# Altium schematic sheet module_tester_v2.0.SchDoc
size 508 x 381 mm
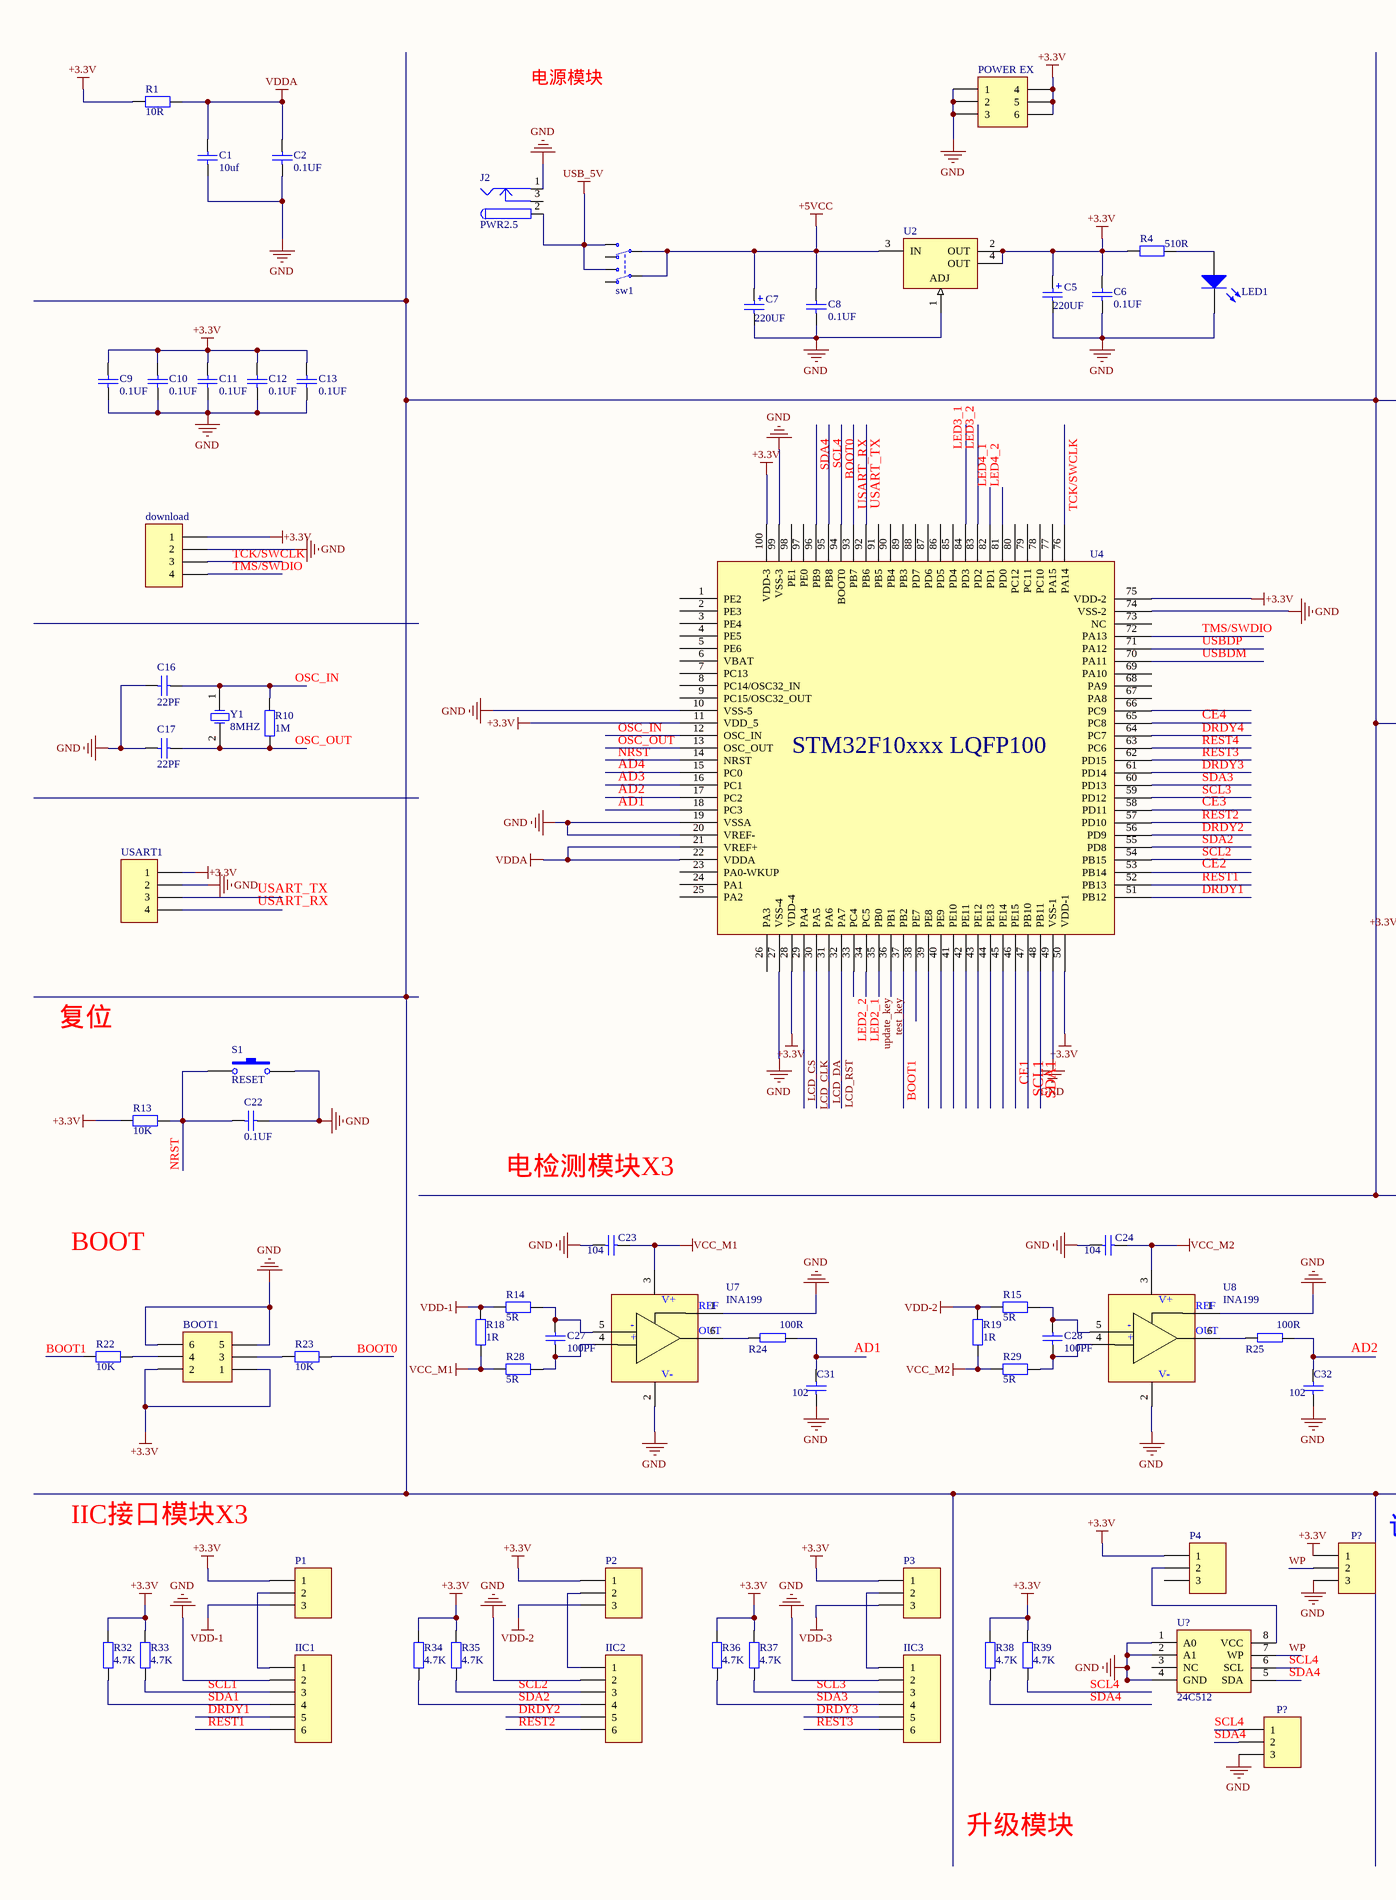
[diagram p0: module_tester_v2.0.SchDoc, left]
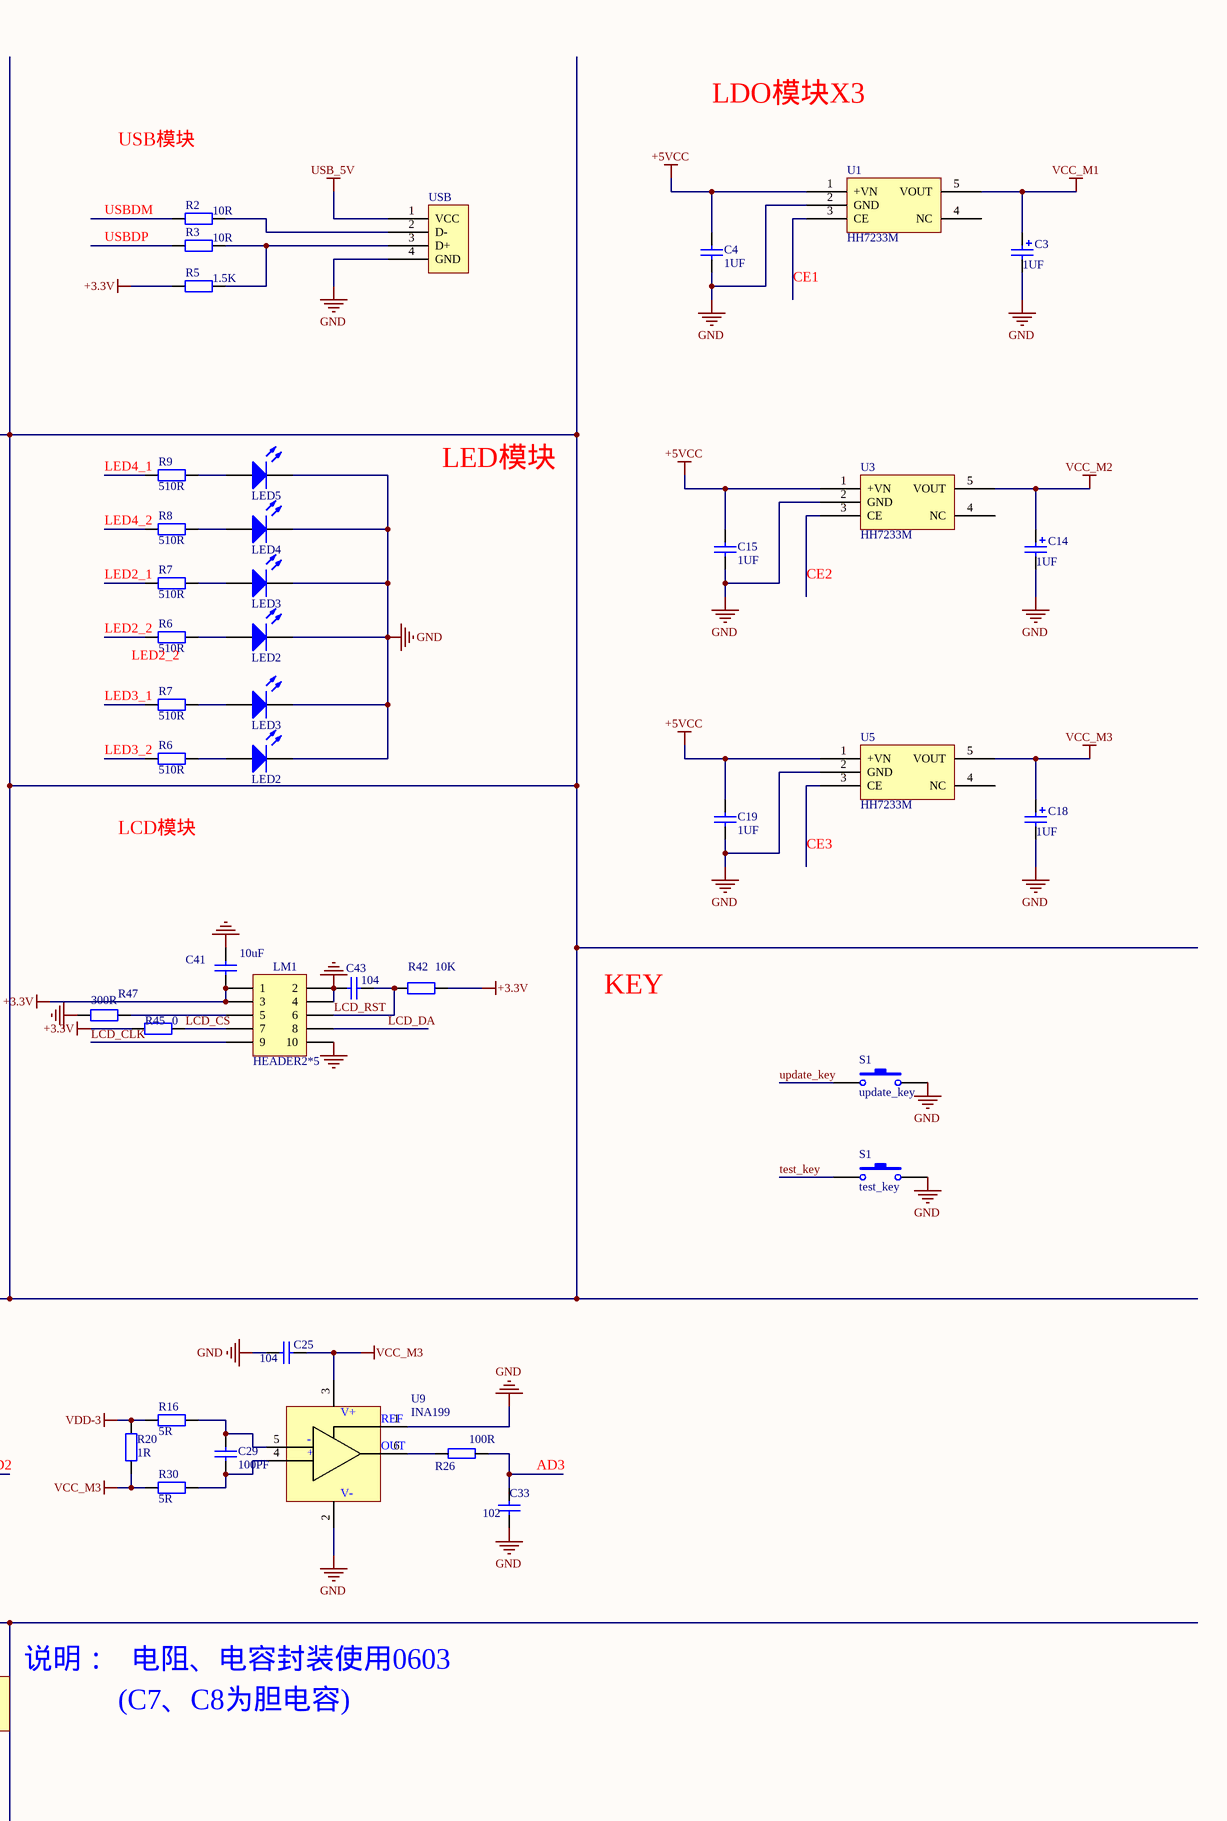
[diagram p1: module_tester_v2.0.SchDoc, right]

## Parts
(Parts that share a designator on the sheet are numbered #1, #2 ... from top to bottom, then left to right.)
BOOT1  Header 3X2  [IDC6]  (value not drawn)
C1  value 10uf  [C0603E]  (hidden comment: Cap)
C2  value 0.1UF  [C0603E]  (hidden comment: Cap)
C3  value 1UF  [C0603E]  (hidden comment: Cap Pol2)
C4  value 1UF  [C0603E]  (hidden comment: Cap)
C5  value 220UF  [C3528]  (hidden comment: Cap Pol2)
C6  value 0.1UF  [C0603E]  (hidden comment: Cap)
C7  value 220UF  [C3528]  (hidden comment: Cap Pol2)
C8  value 0.1UF  [C0603E]  (hidden comment: Cap)
C9  value 0.1UF  [C0603E]  (hidden comment: Cap)
C10  value 0.1UF  [C0603E]  (hidden comment: Cap)
C11  value 0.1UF  [C0603E]  (hidden comment: Cap)
C12  value 0.1UF  [C0603E]  (hidden comment: Cap)
C13  value 0.1UF  [C0603E]  (hidden comment: Cap)
C14  value 1UF  [C0603E]  (hidden comment: Cap Pol2)
C15  value 1UF  [C0603E]  (hidden comment: Cap)
C16  value 22PF  [C0603E]  (hidden comment: Cap)
C17  value 22PF  [C0603E]  (hidden comment: Cap)
C18  value 1UF  [C0603E]  (hidden comment: Cap Pol2)
C19  value 1UF  [C0603E]  (hidden comment: Cap)
C22  value 0.1UF  [C0603E]  (hidden comment: Cap)
C23  104  [C0603E]
C24  104  [C0603E]
C25  104  [C0603E]
C27  value 100PF  [C0603E]  (hidden comment: Cap)
C28  value 100PF  [C0603E]  (hidden comment: Cap)
C29  value 100PF  [C0603E]  (hidden comment: Cap)
C31  102  [C0603E]
C32  102  [C0603E]
C33  102  [C0603E]
C41  10uF  [C0805]
C43  104  [C0805]
download  Header 4H  [header4]  (value not drawn)
IIC1  MHDR1X6  [header6]  (value not drawn)
IIC2  MHDR1X6  [header6]  (value not drawn)
IIC3  MHDR1X6  [header6]  (value not drawn)
J2  PWR2.5  [DC-POWER]
LED1  LED-RED-0603  [LED0603]  (value not drawn)
LED2#1  LED-RED-0603  [LED0603]  (value not drawn)
LED2#2  LED-RED-0603  [LED0603]  (value not drawn)
LED3#1  LED-RED-0603  [LED0603]  (value not drawn)
LED3#2  LED-RED-0603  [LED0603]  (value not drawn)
LED4  LED-RED-0603  [LED0603]  (value not drawn)
LED5  LED-RED-0603  [LED0603]  (value not drawn)
LM1  HEADER2*5  [IDC10]
P1  Header 3  [header3]  (value not drawn)
P2  Header 3  [header3]  (value not drawn)
P3  Header 3  [header3]  (value not drawn)
P4  Header 3  [header3]  (value not drawn)
P?#1  Header 3  [header3]  (value not drawn)
P?#2  Header 3  [header3]  (value not drawn)
POWER_EX  Header 3X2A  [IDC6]  (value not drawn)
R1  value 10R  [R0603E]  (hidden comment: Res2)
R2  value 10R  [R0603E]  (hidden comment: Res2)
R3  value 10R  [R0603E]  (hidden comment: Res2)
R4  value 510R  [R0603E]  (hidden comment: Res2)
R5  value 1.5K  [R0603E]  (hidden comment: Res2)
R6#1  value 510R  [R0603E]  (hidden comment: Res2)
R6#2  value 510R  [R0603E]  (hidden comment: Res2)
R7#1  value 510R  [R0603E]  (hidden comment: Res2)
R7#2  value 510R  [R0603E]  (hidden comment: Res2)
R8  value 510R  [R0603E]  (hidden comment: Res2)
R9  value 510R  [R0603E]  (hidden comment: Res2)
R10  value 1M  [R0603E]  (hidden comment: Res2)
R13  value 10K  [R0603E]  (hidden comment: Res2)
R14  value 5R  [R0603E]  (hidden comment: Res2)
R15  value 5R  [R0603E]  (hidden comment: Res2)
R16  value 5R  [R0603E]  (hidden comment: Res2)
R18  value 1R  [R0603E]  (hidden comment: Res2)
R19  value 1R  [R0603E]  (hidden comment: Res2)
R20  value 1R  [R0603E]  (hidden comment: Res2)
R22  value 10K  [R0603E]  (hidden comment: Res2)
R23  value 10K  [R0603E]  (hidden comment: Res2)
R24  100R  [R0603E]
R25  100R  [R0603E]
R26  100R  [R0603E]
R28  value 5R  [R0603E]  (hidden comment: Res2)
R29  value 5R  [R0603E]  (hidden comment: Res2)
R30  value 5R  [R0603E]  (hidden comment: Res2)
R32  value 4.7K  [R0603E]  (hidden comment: Res2)
R33  value 4.7K  [R0603E]  (hidden comment: Res2)
R34  value 4.7K  [R0603E]  (hidden comment: Res2)
R35  value 4.7K  [R0603E]  (hidden comment: Res2)
R36  value 4.7K  [R0603E]  (hidden comment: Res2)
R37  value 4.7K  [R0603E]  (hidden comment: Res2)
R38  value 4.7K  [R0603E]  (hidden comment: Res2)
R39  value 4.7K  [R0603E]  (hidden comment: Res2)
R42  10K  [R0805]
R45  0  [R0805]
R47  300R  [R0805]
S1#1  update_key  [key6X6]
S1#2  RESET  [key6X6]
S1#3  test_key  [key6X6]
sw1  switch-power  [switch-power]  (value not drawn)
U1  HH7233M  [SOT-23-5]
U2  AMS1117-3.3V  [SOT-223]  (value not drawn)
U3  HH7233M  [SOT-23-5]
U4  STM32F103VCT6  [LC-LQFP-100_14x14x05P]  (value not drawn)
U5  HH7233M  [SOT-23-5]
U7  INA199  [LC-SC-70-6(SOT-363)]
U8  INA199  [LC-SC-70-6(SOT-363)]
U9  INA199  [LC-SC-70-6(SOT-363)]
U?  24C512  [SO-8]
USART1  Header 4  [header4]  (value not drawn)
USB  USB  [USB-B]  (value not drawn)
Y1  8MHZ  [CRY1]

## Nets
+3.3V: BOOT1.1 BOOT1.2 C5.1 C6.2 C9.2 C10.2 C11.2 C12.2 C13.2 C41.2 download.1 LM1.1 LM1.3 P1.1 P2.1 P3.1 P4.1 P?#1.1 POWER_EX.4 POWER_EX.5 POWER_EX.6 R1.2 R4.2 R5.2 R13.2 R32.2 R33.2 R34.2 R35.2 R36.2 R37.2 R38.2 R39.2 R42.1 R45.1 U2.2(OUT) U2.4(OUT) U4.11(VDD_5) U4.28(VDD-4) U4.50(VDD-1) U4.75(VDD-2) U4.100(VDD-3) USART1.1
+5VCC: C4.1 C7.1 C8.2 C15.1 C19.1 sw1.2(COM-1) sw1.5(COM-2) U1.1(+VN) U2.3(IN) U3.1(+VN) U5.1(+VN)
GND: BOOT1.5 BOOT1.6 C1.2 C2.2 C3.2 C4.2 C5.2 C6.1 C7.2 C8.1 C9.1 C10.1 C11.1 C12.1 C13.1 C14.2 C15.2 C16.2 C17.2 C18.2 C19.2 C22.1 C23.1 C24.1 C25.1 C31.2 C32.2 C33.2 C41.1 C43.1 download.2 IIC1.2 IIC2.2 IIC3.2 J2.1 LED1.K LED2#1.K LED2#2.K LED3#1.K LED3#2.K LED4.K LED5.K LM1.2 LM1.4 LM1.10 P?#1.3 P?#2.3 POWER_EX.1 POWER_EX.2 POWER_EX.3 R47.1 S1#1.2 S1#2.2 S1#3.2 U1.2(GND) U2.1(ADJ) U3.2(GND) U4.10(VSS-5) U4.19(VSSA) U4.20(VREF-) U4.27(VSS-4) U4.49(VSS-1) U4.74(VSS-2) U4.99(VSS-3) U5.2(GND) U7.1(REF) U7.2(GND) U8.1(REF) U8.2(GND) U9.1(REF) U9.2(GND) U?.1(A0) U?.2(A1) U?.4(GND) USART1.2 USB.4(GND)
USB_5V: J2.2 sw1.1(N.O-1) sw1.4(N.O-2) USB.1(VCC)
VCC_M1: C3.1 C23.2 R18.2 R28.2 U1.5(VOUT) U7.3(V+)
VCC_M2: C14.1 C24.2 R19.2 R29.2 U3.5(VOUT) U8.3(V+)
VCC_M3: C18.1 C25.2 R20.2 R30.2 U5.5(VOUT) U9.3(V+)
VDD-1: P1.3 R14.2 R18.1
VDD-2: P2.3 R15.2 R19.1
VDD-3: P3.3 R16.2 R20.1
VDDA: C1.1 C2.1 R1.1 U4.21(VREF+) U4.22(VDDA)
AD1: C31.1 R24.1 U4.18(PC3)
AD2: C32.1 R25.1 U4.17(PC2)
AD3: C33.1 R26.1 U4.16(PC1)
AD4: U4.15(PC0)
BOOT0: R23.1 U4.94(BOOT0)
BOOT1: R22.2 U4.37(PB2)
CE1: U1.3(CE) U4.46(PE15)
CE2: U3.3(CE) U4.53(PB14)
CE3: U4.58(PD11) U5.3(CE)
CE4: U4.65(PC8)
DRDY1: IIC1.5 U4.51(PB12)
DRDY2: IIC2.5 U4.56(PD9)
DRDY3: IIC3.5 U4.61(PD14)
DRDY4: U4.64(PC7)
LCD_CLK: LM1.9 U4.30(PA5)
LCD_CS: LM1.7 R45.2 U4.29(PA4)
LCD_DA: LM1.8 U4.31(PA6)
LCD_RST: C43.2 LM1.6 R42.2 U4.32(PA7)
LED2_1: R7#1.1 U4.34(PC5)
LED2_2: R6#1.2 U4.33(PC4)
LED3_1: R7#2.1 U4.84(PD3)
LED3_2: R6#2.2 U4.83(PD2)
LED4_1: R9.1 U4.82(PD1)
LED4_2: R8.2 U4.81(PD0)
NRST: C22.2 R13.1 S1#2.1 U4.14(NRST)
OSC_IN: C16.1 R10.1 U4.12(OSC_IN) Y1.1(OSC1)
OSC_OUT: C17.1 R10.2 U4.13(OSC_OUT) Y1.2(OSC2)
REST1: IIC1.6 U4.52(PB13)
REST2: IIC2.6 U4.57(PD10)
REST3: IIC3.6 U4.62(PD15)
REST4: U4.63(PC6)
SCL1: IIC1.3 R33.1 U4.47(PB10)
SCL2: IIC2.3 R35.1 U4.54(PB15)
SCL3: IIC3.3 R37.1 U4.59(PD12)
SCL4: P?#2.1 R39.1 U4.95(PB8) U?.6(SCL)
SDA1: IIC1.4 R32.1 U4.48(PB11)
SDA2: IIC2.4 R34.1 U4.55(PD8)
SDA3: IIC3.4 R36.1 U4.60(PD13)
SDA4: P?#2.2 R38.1 U4.96(PB9) U?.5(SDA)
TCK/SWCLK: download.3 U4.76(PA14)
test_key: S1#3.1 U4.36(PB1)
TMS/SWDIO: download.4 U4.72(PA13)
update_key: S1#1.1 U4.35(PB0)
USART_RX: U4.93(PB7) USART1.4
USART_TX: U4.92(PB6) USART1.3
USBDM: R2.2 U4.70(PA11)
USBDP: R3.2 U4.71(PA12)
WP: P?#1.2 U?.7(WP)
NetBOOT1_3: BOOT1.3 R23.2
NetBOOT1_4: BOOT1.4 R22.1
NetC27_1: C27.1 R14.1 U7.5(IN-)
NetC27_2: C27.2 R28.1 U7.4(IN+)
NetC28_1: C28.1 R15.1 U8.5(IN-)
NetC28_2: C28.2 R29.1 U8.4(IN+)
NetC29_1: C29.1 R16.1 U9.5(IN-)
NetC29_2: C29.2 R30.1 U9.4(IN+)
NetIIC1_1: IIC1.1 P1.2
NetIIC2_1: IIC2.1 P2.2
NetIIC3_1: IIC3.1 P3.2
NetLED1_A: LED1.A R4.1
NetLED2#1_A: LED2#1.A R6#1.1
NetLED2#2_A: LED2#2.A R6#2.1
NetLED3#1_A: LED3#1.A R7#1.2
NetLED3#2_A: LED3#2.A R7#2.2
NetLED4_A: LED4.A R8.1
NetLED5_A: LED5.A R9.2
NetLM1_5: LM1.5 R47.2
NetP4_2: P4.2 U?.8(VCC)
NetR2_1: R2.1 USB.2(D-)
NetR3_1: R3.1 R5.1 USB.3(D+)
NetR24_2: R24.2 U7.6(OUT)
NetR25_2: R25.2 U8.6(OUT)
NetR26_2: R26.2 U9.6(OUT)

Not connected (* = marked no-connect by the designer): J2 3; P4 3; sw1 3(N.C-1) 6(N.C-2); U1 4(NC); U3 4(NC); U4 1(PE2) 2(PE3) 3(PE4) 4(PE5) 5(PE6) 6(VBAT) 7(PC13) 8(PC14/OSC32_IN) 9(PC15/OSC32_OUT) 23(PA0-WKUP) 24(PA1) 25(PA2) 26(PA3) 38(PE7) 39(PE8) 40(PE9) 41(PE10) 42(PE11) 43(PE12) 44(PE13) 45(PE14) 66(PC9) 67(PA8) 68(PA9) 69(PA10) 73(NC) 77(PA15) 78(PC10) 79(PC11) 80(PC12) 85(PD4) 86(PD5) 87(PD6) 88(PD7) 89(PB3) 90(PB4) 91(PB5) 97(PE0) 98(PE1); U5 4(NC); U? 3(NC)

## Notes on the sheet
- Labels drawn without touching a wire or pin: (C7、C8为胆电容), BOOT, IIC接口模块X3, KEY, LCD模块, LDO模块X3, LED2_2, LED模块, USB模块, 升级模块, 复位, 电检测模块X3, 电源模块, 电阻、电容封装使用0603, 说明：
- (in symbol INA199) -; +; V-
- (in symbol STM32F407ZET6) STM32F10xxx LQFP100

## Library data of the parts
BOOT1 = Header 3X2: Header, 3-Pin, Dual row; LatestRevisionDate: 17-Jul-2002; LatestRevisionNote: Re-released for DXP Platform.; Publisher: Altium Limited
C1 C2 C4 C6 C8-C13 C15-C17 C19 C22 C27-C29 = Cap: Capacitor; Published: 8-Jun-2000; LatestRevisionDate: 17-Jul-2002; LatestRevisionNote: Re-released for DXP Platform.; PackageReference: RAD-0.3; Publisher: Altium Limited; PackageDescription: Radial Cap, Thru-Hole; 2 Leads; 0.3 in Pin Spacing
C3 C5 C7 C14 C18 = Cap Pol2: Polarized Capacitor (Axial); Published: 8-Jun-2000; LatestRevisionDate: 17-Jul-2002; LatestRevisionNote: Re-released for DXP Platform.; PackageReference: POLAR0.8; Publisher: Altium Limited; PackageDescription: Polarized Capacitor; 2 Leads
C23-C25 C31-C33 C41 C43 = Cap Semi: Capacitor (Semiconductor SIM Model); Published: 8-Jun-2000; LatestRevisionDate: 17-Jul-2002; LatestRevisionNote: Re-released for DXP Platform.; PackageReference: C1206; Publisher: Altium Limited
download = Header 4H: Header, 4-Pin, Right Angle; LatestRevisionDate: 17-Jul-2002; LatestRevisionNote: Re-released for DXP Platform.; Publisher: Altium Limited
IIC1-IIC3 = MHDR1X6: Header, 6-Pin; LatestRevisionDate: 17-Jul-2002; LatestRevisionNote: Re-released for DXP Platform.; Publisher: Altium Limited
J2 = PWR2.5: Low Voltage Power Supply Connector; Published: 17-Dec-2003; DatasheetDocument: 09-May-2002; Publisher: Altium Limited; ComponentLink1Description: Manufacturer Link; ComponentLink1URL: http://domino.kycon.com/internet/Products.html
LED1 LED2#1 LED2#2 LED3#1 LED3#2 LED4 LED5 = LED-0603
P1-P4 P?#1 P?#2 = Header 3: Header, 3-Pin; LatestRevisionDate: 17-Jul-2002; LatestRevisionNote: Re-released for DXP Platform.; Publisher: Altium Limited
POWER_EX = Header 3X2A: Header, 3-Pin, Dual row; LatestRevisionDate: 17-Jul-2002; LatestRevisionNote: Re-released for DXP Platform.; Publisher: Altium Limited
R1-R5 R6#1 R6#2 R7#1 R7#2 R8-R10 R13-R16 R18-R20 R22 R23 R28-R30 R32-R39 R42 R45 R47 = Res2: Resistor; Published: 8-Jun-2000; LatestRevisionDate: 17-Jul-2002; LatestRevisionNote: Re-released for DXP Platform.; Publisher: Altium Limited
  R1-R5 R6#1 R6#2 R7#1 R7#2 R8-R10 R13-R16 R18-R20 R22 R23 R28-R30 R32-R39: PackageReference: AXIAL-0.4; PackageDescription: Axial Device, Thru-Hole; 2 Leads; 0.4 in Pin Spacing
R24-R26 = R
S1#1-S1#3 = SW-PB: Switch; Published: 24-Mar-1999; LatestRevisionDate: 17-Jul-2002; LatestRevisionNote: Re-released for DXP Platform.; PackageReference: SPST-2; Publisher: Altium Limited; PackageDescription: Switch; 2 Leads
U1 U3 U5 = HH72XXM
U2 = LM317MSTT3: Three-Terminal Adjustable Output Positive Voltage Regulator; Note: Pin 2 is electrically connected to Pin 4 (TAB); Published: 15-Apr-2002; DatasheetDocument: Nov-1999; PackageDocument: Nov-1999; PackageReference: 318E-04; Publisher: Altium Limited; ComponentLink1Description: Manufacturer Link; ComponentLink1URL: http://www.onsemi.com/
U4 = STM32F407ZET6
U? = AD8400
USART1 = Header 4: Header, 4-Pin; LatestRevisionDate: 17-Jul-2002; LatestRevisionNote: Re-released for DXP Platform.; Publisher: Altium Limited
Y1 = XTAL: Crystal Oscillator; Published: 8-Jun-2000; LatestRevisionDate: 17-Jul-2002; LatestRevisionNote: Re-released for DXP Platform.; PackageReference: R38; Publisher: Altium Limited; PackageDescription: Crystal, Thru-Hole; 2 Leads; Body 3.1 x 8.2 mm (Dia.xH)